# EAGLE design 4 (EAGLE 7.2.0)
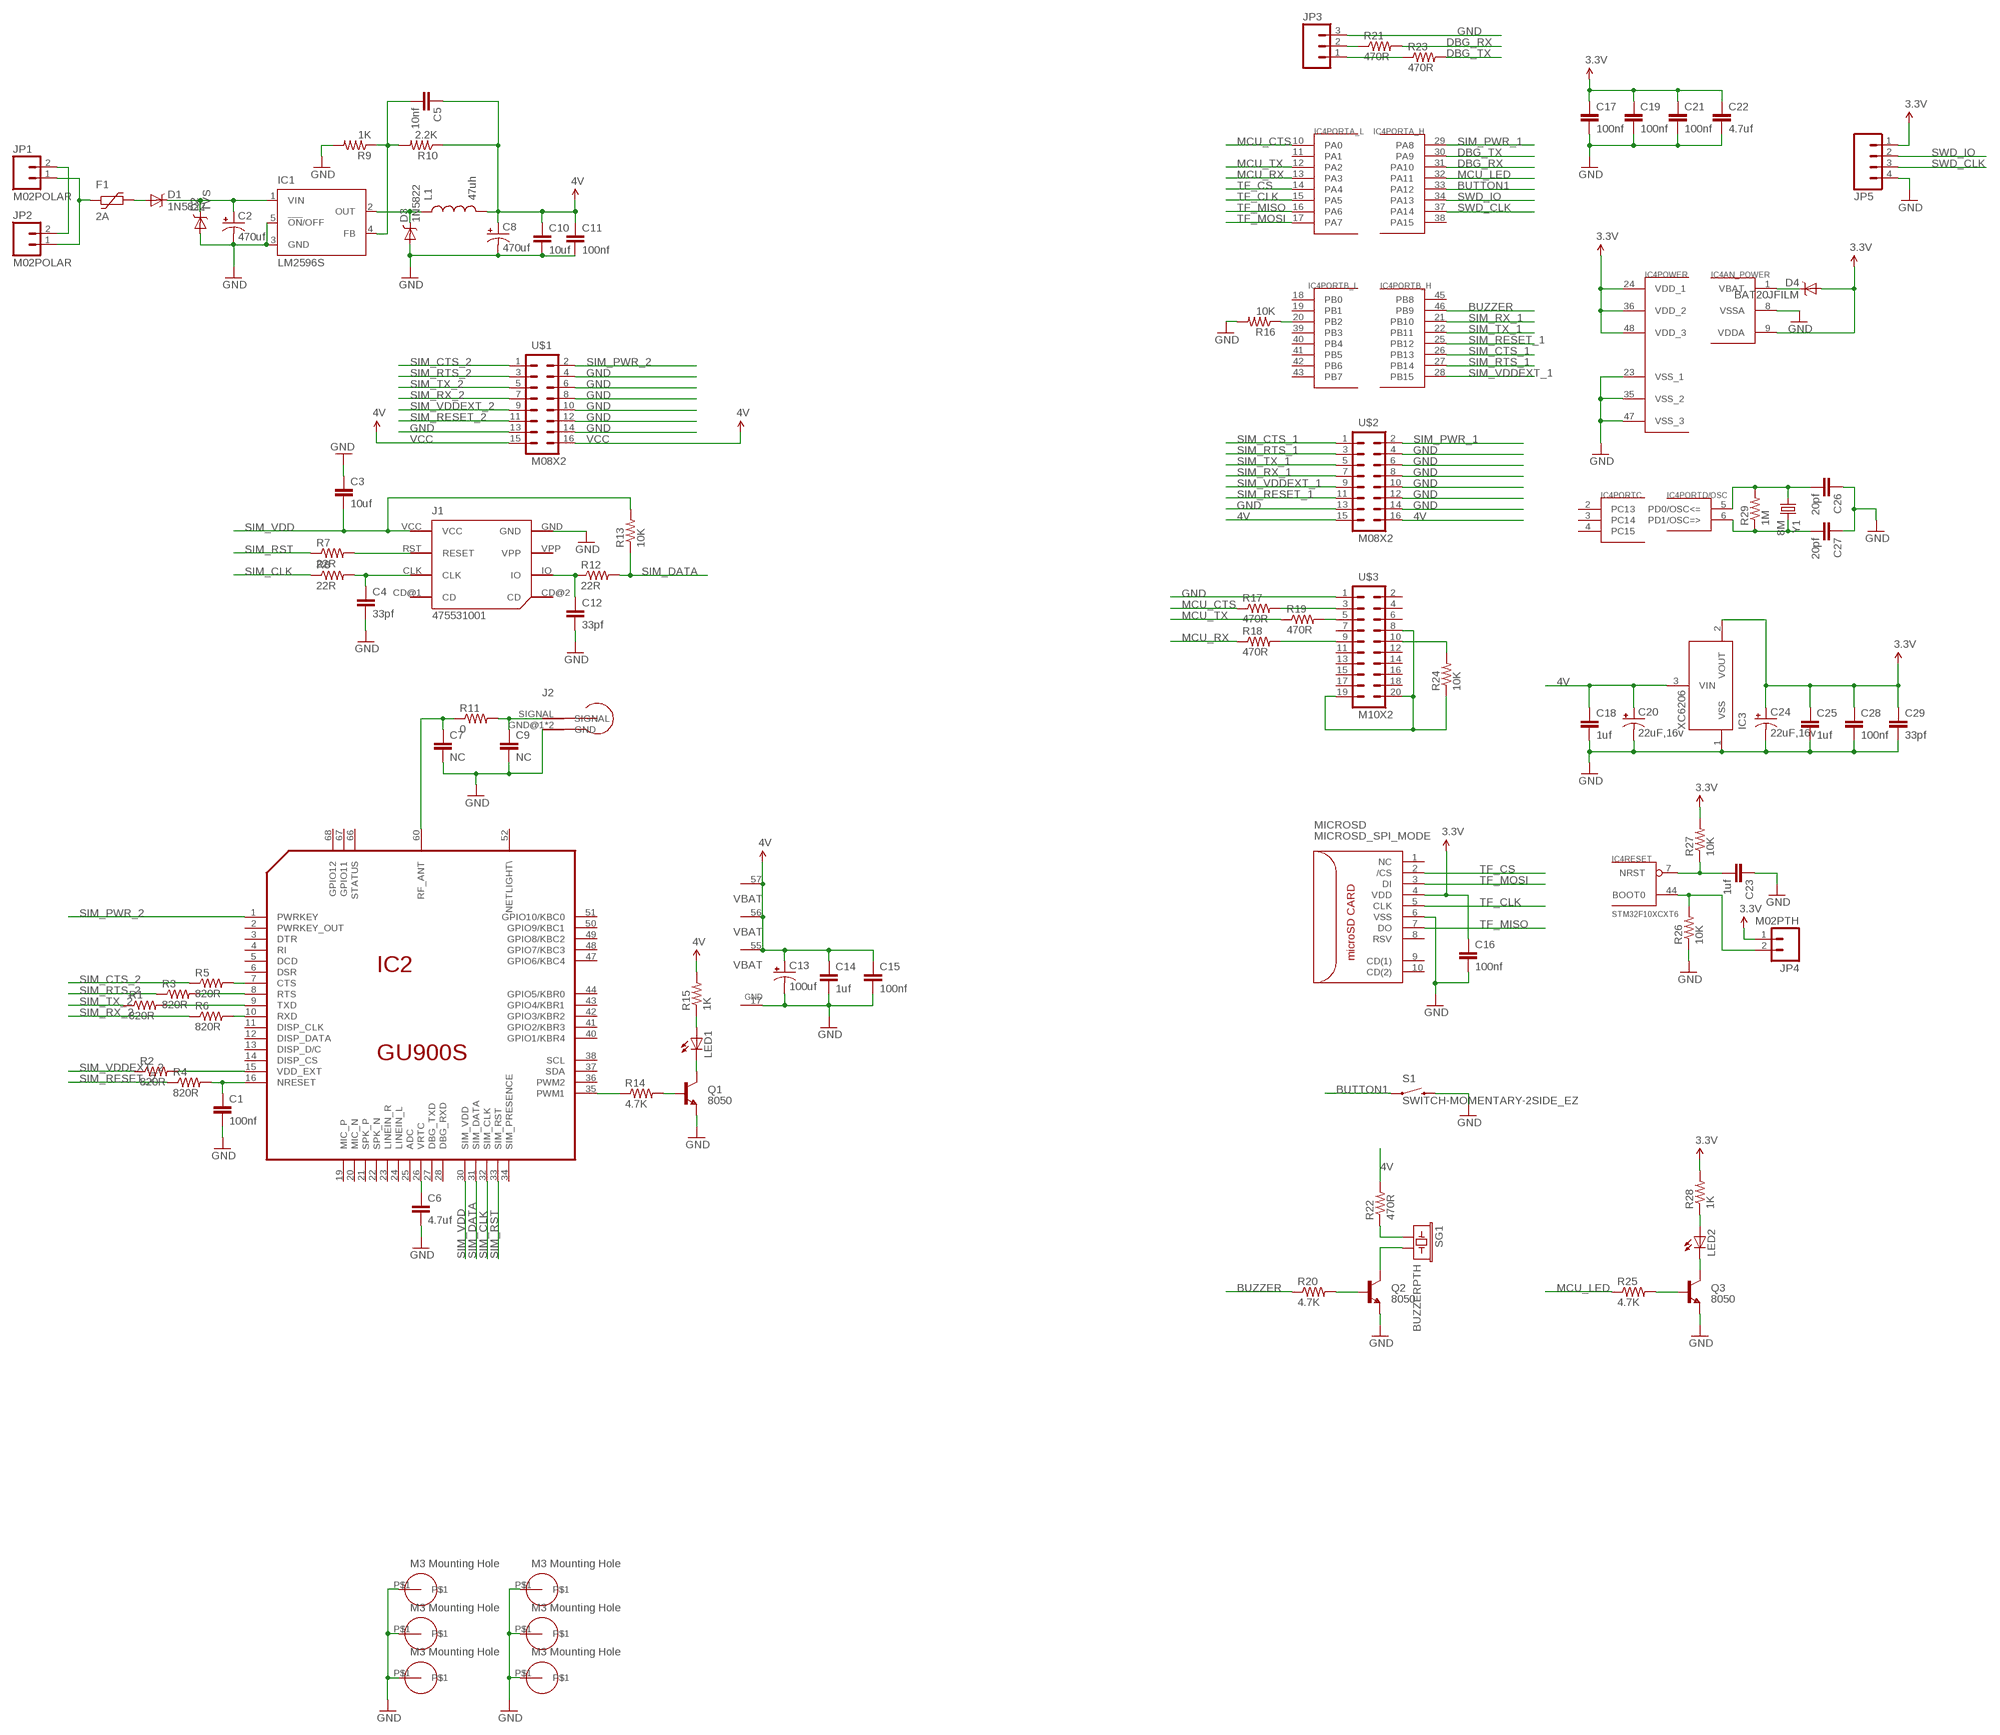
[diagram p0: schematic, sheet 1]

## Parts
C1  100nf  CAP0603-CAP  [0603-CAP]
C2  470uf  CAP_POLPTH4  [CPOL-RADIAL-1000UF-25V]
C3  10uf  CAP0603-CAP  [0603-CAP]
C4  33pf  CAP0603-CAP  [0603-CAP]
C5  10nf  CAP0603-CAP  [0603-CAP]
C6  4.7uf  CAP0603-CAP  [0603-CAP]
C7  NC  CAP0603-CAP  [0603-CAP]
C8  470uf  CAP_POLPTH4  [CPOL-RADIAL-1000UF-25V]
C9  NC  CAP0603-CAP  [0603-CAP]
C10  10uf  CAP0603-CAP  [0603-CAP]
C11  100nf  CAP0603-CAP  [0603-CAP]
C12  33pf  CAP0603-CAP  [0603-CAP]
C13  100uf  CAP_POL6032  [EIA6032]
C14  1uf  CAP0603-CAP  [0603-CAP]
C15  100nf  CAP0603-CAP  [0603-CAP]
C16  100nf  CAP0603-CAP  [0603-CAP]
C17  100nf  CAP0603-CAP  [0603-CAP]
C18  1uf  CAP0603-CAP  [0603-CAP]
C19  100nf  CAP0603-CAP  [0603-CAP]
C20  22uF,16v  10UF-20V-10%(TANT)  [EIA3528]
C21  100nf  CAP0603-CAP  [0603-CAP]
C22  4.7uf  CAP0603-CAP  [0603-CAP]
C23  1uf  CAP0603-CAP  [0603-CAP]
C24  22uF,16v  10UF-20V-10%(TANT)  [EIA3528]
C25  1uf  CAP0603-CAP  [0603-CAP]
C26  20pf  CAP0603-CAP  [0603-CAP]
C27  20pf  CAP0603-CAP  [0603-CAP]
C28  100nf  CAP0603-CAP  [0603-CAP]
C29  33pf  CAP0603-CAP  [0603-CAP]
D1  1N5822  DIODE-SCHOTTKT-SMB  [SMB-DIODE]
D2  TVS  TVS_SMB  [SMB-DIODE]
D3  1N5822  DIODE-SCHOTTKT-SMB  [SMB-DIODE]
D4  BAT20JFILM  [SOD-323]
F1  2A  PTC-FUSE1812L  [1812L]
IC1  LM2596S  [TO263-5]
IC2  GU900S  SIM900  [SIM900]
IC3  XC6206  [SOT23-3]
IC4  STM32F10XCXT6  [TQFP48]
J1  475531001  [475531001]
J2  IPEX  [IPEX]
JP1  M02POLAR  [MOLEX-1X2]
JP2  M02POLAR  [MOLEX-1X2]
JP3  M03PTH  [1X03]
JP4  M02PTH  [1X02]
JP5  M04PTH  [1X04]
L1  47uh  IHLP4040DZ  [IHLP4040DZ]
LED1  LEDSML0805  [SML0805]
LED2  LED3MM  [LED3MM]
MICROSD  MICROSD_SPI_MODE  [MICRO_SD_CONNECTOR]
Q1  8050  TRANSISTOR_NPNSOT23  [SOT23]
Q2  8050  TRANSISTOR_NPNSOT23  [SOT23]
Q3  8050  TRANSISTOR_NPNSOT23  [SOT23]
R1  820R  RESISTOR0603-RES  [0603-RES]
R2  820R  RESISTOR0603-RES  [0603-RES]
R3  820R  RESISTOR0603-RES  [0603-RES]
R4  820R  RESISTOR0603-RES  [0603-RES]
R5  820R  RESISTOR0603-RES  [0603-RES]
R6  820R  RESISTOR0603-RES  [0603-RES]
R7  22R  1M-1%  [0603-RES]
R8  22R  1M-1%  [0603-RES]
R9  1K  RESISTOR0603-RES  [0603-RES]
R10  2.2K  RESISTOR0603-RES  [0603-RES]
R11  0  1M-1%  [0603-RES]
R12  22R  1M-1%  [0603-RES]
R13  10K  1M-1%  [0603-RES]
R14  4.7K  1M-1%  [0603-RES]
R15  1K  RESISTOR0603-RES  [0603-RES]
R16  10K  1M-1%  [0603-RES]
R17  470R  1M-1%  [0603-RES]
R18  470R  1M-1%  [0603-RES]
R19  470R  1M-1%  [0603-RES]
R20  4.7K  1M-1%  [0603-RES]
R21  470R  1M-1%  [0603-RES]
R22  470R  1M-1%  [0603-RES]
R23  470R  1M-1%  [0603-RES]
R24  10K  1M-1%  [0603-RES]
R25  4.7K  1M-1%  [0603-RES]
R26  10K  RESISTOR0603-RES  [0603-RES]
R27  10K  RESISTOR0603-RES  [0603-RES]
R28  1K  1M-1%  [0603-RES]
R29  1M  1M-1%  [0603-RES]
S1  SWITCH-MOMENTARY-2SIDE_EZ  [TACTILE-PTH-SIDEEZ]
SG1  BUZZERPTH  [BUZZER-12MM]
U$1  M08X2  [2X8]
U$2  M08X2  [2X8]
U$3  M10X2  [2X10]
U$4  M3_MOUNTING_HOLE  [M3_MOUNTING_HOLE]
U$5  M3_MOUNTING_HOLE  [M3_MOUNTING_HOLE]
U$7  M3_MOUNTING_HOLE  [M3_MOUNTING_HOLE]
U$8  M3_MOUNTING_HOLE  [M3_MOUNTING_HOLE]
U$10  M3_MOUNTING_HOLE  [M3_MOUNTING_HOLE]
U$11  M3_MOUNTING_HOLE  [M3_MOUNTING_HOLE]
Y1  8M  CRYSTALHC49US  [HC49US]

## Nets
3.3V: C16.1 C17.1 C19.1 C21.1 C22.1 C24.A(+) C25.1 C28.1 C29.1 D4.2(A) IC3.2(VOUT) IC4.9(AN_POWER:VDDA) IC4.24(POWER:VDD_1) IC4.36(POWER:VDD_2) IC4.48(POWER:VDD_3) JP4.1 JP5.1 MICROSD.4(VDD) R27.2 R28.2
4V: C18.1 C20.A(+) IC3.3(VIN) R22.2 U$2.15 U$2.16
BUTTON1: IC4.33(PORTA_H:PA12) S1.1
BUZZER: IC4.46(PORTB_H:PB9) R20.1
DBG_RX: IC4.31(PORTA_H:PA10) R21.2
DBG_TX: IC4.30(PORTA_H:PA9) R23.2
GND: C1.2 C2.2(-) C3.1 C4.2 C6.2 C7.2 C8.2(-) C9.2 C10.2 C11.2 C12.2 C13.P$2(-) C14.2 C15.2 C16.2 C17.2 C18.2 C19.2 C20.C(-) C21.2 C22.2 C23.1 C24.C(-) C25.2 C26.1 C27.1 C28.2 C29.2 D2.A D3.A IC1.3(GND) IC1.5(!ON!/OFF) IC2.17(GND) IC3.1(VSS) IC4.8(AN_POWER:VSSA) IC4.23(POWER:VSS_1) IC4.35(POWER:VSS_2) IC4.47(POWER:VSS_3) J1.GND J2.GND@1(GND) J2.GND@2(GND) JP3.3 JP5.4 MICROSD.6(VSS) Q1.2(E) Q2.2(E) Q3.2(E) R9.2 R16.2 R26.1 S1.2 U$1.4 U$1.6 U$1.8 U$1.10 U$1.12 U$1.13 U$1.14 U$2.4 U$2.6 U$2.8 U$2.10 U$2.12 U$2.13 U$2.14 U$3.1 U$4.P$1 U$5.P$1 U$7.P$1 U$8.P$1 U$10.P$1 U$11.P$1
MCU_CTS: IC4.10(PORTA_L:PA0) R17.1
MCU_LED: IC4.32(PORTA_H:PA11) R25.1
MCU_RX: IC4.13(PORTA_L:PA3) R18.1
MCU_TX: IC4.12(PORTA_L:PA2) R19.1
N$1: D4.1(C) IC4.1(AN_POWER:VBAT)
N$2: C26.2 IC4.5(PORTD/OSC:PD0/OSC<=) R29.2 Y1.1
N$3: C27.2 IC4.6(PORTD/OSC:PD1/OSC=>) R29.1 Y1.2
N$4: C23.2 IC4.7(RESET:NRST) R27.1
N$5: IC4.44(RESET:BOOT0) JP4.2 R26.2
N$6: R24.1 U$3.8 U$3.19 U$3.20
N$7: JP1.2 JP2.2
N$8: D3.C IC1.2(OUT) L1.P$1
N$9: C2.1(+) D1.C D2.C IC1.1(VIN)
N$10: F1.P$1 JP1.1 JP2.1
N$11: C5.2 IC1.4(FB) R9.1 R10.2
N$12: R17.2 U$3.3
N$13: R19.2 U$3.5
N$14: LED1.C Q1.3(C)
N$15: R24.2 U$3.10
N$16: C7.1 IC2.60(RF_ANT) R11.1
N$17: IC4.20(PORTB_L:PB2) R16.1
N$18: C9.1 J2.SIGNAL R11.2
N$19: D1.A F1.P$2
N$20: IC2.15(VDD_EXT) R2.2
N$21: IC2.35(PWM1) R14.1
N$22: Q1.1(B) R14.2
N$23: LED1.A R15.1
N$24: J1.RST(RESET) R7.2
N$25: C6.1 IC2.26(VRTC)
N$27: Q3.1(B) R25.2
N$29: C1.1 IC2.16(NRESET) R4.2
N$30: IC2.7(CTS) R5.2
N$33: IC2.8(RTS) R3.2
N$34: IC2.9(TXD) R1.2
N$35: C12.1 J1.IO R12.1
N$36: IC2.10(RXD) R6.2
N$37: JP3.2 R21.1
N$38: JP3.1 R23.1
N$39: C4.1 J1.CLK R8.2
N$57: Q2.1(B) R20.2
N$58: R22.1 SG1.+
N$59: Q2.3(C) SG1.-
N$60: R18.2 U$3.9
N$61: LED2.A R28.1
N$62: LED2.K(C) Q3.3(C)
SIM_CLK: IC2.32(SIM_CLK) R8.1
SIM_CTS_1: IC4.26(PORTB_H:PB13) U$2.1
SIM_CTS_2: R5.1 U$1.1
SIM_DATA: IC2.31(SIM_DATA) R12.2 R13.1
SIM_PWR_1: IC4.29(PORTA_H:PA8) U$2.2
SIM_PWR_2: IC2.1(PWRKEY) U$1.2
SIM_RESET_1: IC4.25(PORTB_H:PB12) U$2.11
SIM_RESET_2: R4.1 U$1.11
SIM_RST: IC2.33(SIM_RST) R7.1
SIM_RTS_1: IC4.27(PORTB_H:PB14) U$2.3
SIM_RTS_2: R3.1 U$1.3
SIM_RX_1: IC4.21(PORTB_H:PB10) U$2.7
SIM_RX_2: R6.1 U$1.7
SIM_TX_1: IC4.22(PORTB_H:PB11) U$2.5
SIM_TX_2: R1.1 U$1.5
SIM_VDD: C3.2 IC2.30(SIM_VDD) J1.VCC R13.2
SIM_VDDEXT_1: IC4.28(PORTB_H:PB15) U$2.9
SIM_VDDEXT_2: R2.1 U$1.9
SWD_CLK: IC4.37(PORTA_H:PA14) JP5.3
SWD_IO: IC4.34(PORTA_H:PA13) JP5.2
TF_CLK: IC4.15(PORTA_L:PA5) MICROSD.5(CLK)
TF_CS: IC4.14(PORTA_L:PA4) MICROSD.2(/CS)
TF_MISO: IC4.16(PORTA_L:PA6) MICROSD.7(DO)
TF_MOSI: IC4.17(PORTA_L:PA7) MICROSD.3(DI)
VCC: C5.1 C8.1(+) C10.1 C11.1 C13.P$1(+) C14.1 C15.1 IC2.55(VBAT) IC2.56(VBAT) IC2.57(VBAT) L1.P$2 R10.1 R15.2 U$1.15 U$1.16 ; supply symbol labelled 4V
Unconnected: IC2.2(PWRKEY_OUT) IC2.3(DTR) IC2.4(RI) IC2.5(DCD) IC2.6(DSR) IC2.11(DISP_CLK) IC2.12(DISP_DATA) IC2.13(DISP_D/C) IC2.14(DISP_CS) IC2.19(MIC_P) IC2.20(MIC_N) IC2.21(SPK_P) IC2.22(SPK_N) IC2.23(LINEIN_R) IC2.24(LINEIN_L) IC2.25(ADC) IC2.27(DBG_TXD) IC2.28(DBG_RXD) IC2.34(SIM_PRESENCE) IC2.36(PWM2) IC2.37(SDA) IC2.38(SCL) IC2.40(GPIO1/KBR4) IC2.41(GPIO2/KBR3) IC2.42(GPIO3/KBR2) IC2.43(GPIO4/KBR1) IC2.44(GPIO5/KBR0) IC2.47(GPIO6/KBC4) IC2.48(GPIO7/KBC3) IC2.49(GPIO8/KBC2) IC2.50(GPIO9/KBC1) IC2.51(GPIO10/KBC0) IC2.52(NETLIGHT\) IC2.66(STATUS) IC2.67(GPIO11) IC2.68(GPIO12) IC4.2(PORTC:PC13) IC4.3(PORTC:PC14) IC4.4(PORTC:PC15) IC4.11(PORTA_L:PA1) IC4.18(PORTB_L:PB0) IC4.19(PORTB_L:PB1) IC4.38(PORTA_H:PA15) IC4.39(PORTB_L:PB3) IC4.40(PORTB_L:PB4) IC4.41(PORTB_L:PB5) IC4.42(PORTB_L:PB6) IC4.43(PORTB_L:PB7) IC4.45(PORTB_H:PB8) J1.CD@1(CD) J1.CD@2(CD) J1.VPP MICROSD.1(NC) MICROSD.8(RSV) MICROSD.9(CD(1)) MICROSD.10(CD(2)) U$3.2 U$3.4 U$3.6 U$3.7 U$3.11 U$3.12 U$3.13 U$3.14 U$3.15 U$3.16 U$3.17 U$3.18

## Power pins joined to a net without a drawn wire
GND: IC2.18(GND) IC2.29(GND) IC2.39(GND) IC2.45(GND) IC2.46(GND) IC2.53(GND) IC2.54(GND) IC2.58(GND) IC2.59(GND) IC2.61(GND) IC2.62(GND) IC2.63(GND) IC2.64(GND) IC2.65(GND)

## Library data of the parts
C1 C3-C7 C9-C12 C14-C19 C21-C23 C25-C29 = SparkFun-Passives:CAP: Capacitor Standard 0603 ceramic capacitor, and 0.1" leaded capacitor.
C2 C8 = SparkFun-Capacitors:CAP_POL: Capacitor Polarized These are standard SMD and PTH capacitors. Normally 10uF, 47uF, and 100uF in electrolytic and tantalum varieties. Always verify the external diameter of the through hole cap, it varies with capacity, voltage, and manufacturer. The EIA devices should be standard.
C13 = SparkFun-Passives:CAP_POL: Capacitor Polarized These are standard SMD and PTH capacitors. Normally 10uF, 47uF, and 100uF in electrolytic and tantalum varieties. Always verify the external diameter of the through hole cap, it varies with capacity, voltage, and manufacturer. The EIA devices should be standard.
C20 C24 = SparkFun-Capacitors:10UF-20V-10%(TANT): CAP-08063; PROD_ID: CAP-08063; VALUE: 10uF
D1 D3 = SparkFun-DiscreteSemi:DIODE-SCHOTTKT-SMB
D2 = SparkFun-DiscreteSemi:TVS_SMB
D4 = SparkFun-DiscreteSemi:BAT20JFILM: 23V, 1A Schottky diode, SOD-323 package; PROD_ID: DIO-11623
F1 = digital-toy:PTC-FUSE
IC1 = national-semiconductor:LM2596: SIMPLE SWITCHER® Power Converter 150 kHz 3A Step-Down Voltage Regulator Source: http://www.national.com/ds/LM/LM2596.pdf
IC2 = sim900:SIM900
IC3 = SparkFun-PowerIC:XC6206: Low ESR Cap. Compatible Positive Voltage Regulator
IC4 = stm32:STM32F10XCXT6: ST STM32F101/103 48pin LQFP
J1 = simcard:475531001: MOLEX SIM Card Holder 47553-1001 1.27mm Pitch SIM Card Holder with 2 Detect Pins, 6 Circuits, Push-Push Style, Housing Height 1.80mm, with Pegs, Lead-Free
J2 = SparkFun-RF:IPEX
JP1 JP2 JP4 = SparkFun-Connectors:M02: Standard 2-pin 0.1" header. Use with - straight break away headers ( PRT-00116) - right angle break away headers (PRT-00553) - swiss pins (PRT-00743) - machine pins (PRT-00117) - female headers (PRT-00115) Molex polarized connector foot print use with: PRT-08233 with associated crimp pins and housings. 2.54_SCREWTERM for use with PRT-10571. 3.5mm Screw Terminal footprints for PRT-08084 5mm Screw Terminal footprints for use with PRT-08433
JP3 = SparkFun-Connectors:M03: Header 3 Standard 3-pin 0.1" header. Use with straight break away headers (SKU : PRT-00116), right angle break away headers (PRT-00553), swiss pins (PRT-00743), machine pins (PRT-00117), and female headers (PRT-00115). Molex polarized connector foot print use with SKU : PRT-08232 with associated crimp pins and housings.
JP5 = SparkFun-Connectors:M04: Header 4 Standard 4-pin 0.1" header. Use with straight break away headers (SKU : PRT-00116), right angle break away headers (PRT-00553), swiss pins (PRT-00743), machine pins (PRT-00117), and female headers (PRT-00115). Molex polarized connector foot print use with SKU : PRT-08231 with associated crimp pins and housings. 1MM SMD Version SKU: PRT-10208
L1 = SparkFun-Passives:IHLP4040DZ
LED1 = led:LED: LED OSRAM: - CHIPLED LG R971, LG N971, LY N971, LG Q971, LY Q971, LO R971, LY R971 LH N974, LH R974 LS Q976, LO Q976, LY Q976 LO Q996 - Hyper CHIPLED LW Q18S LB Q993, LB Q99A, LB R99A - SideLED LS A670, LO A670, LY A670, LG A670, LP A670 LB A673, LV A673, LT A673, LW A673 LH A674 LY A675 LS A676, LA A676, LO A676, LY A676, LW A676 LS A679, LY A679, LG A679 - Hyper Micro SIDELED® LS Y876, LA Y876, LO Y876, LY Y876 LT Y87S - SmartLED LW L88C, LW L88S LB L89C, LB L89S, LG L890 LS L89K, LO L89K, LY L89K LS L896, LA L896, LO L896, LY L896 - TOPLED LS T670, LO T670, LY T670, LG T670, LP T670 LSG T670, LSP T670, LSY T670, LOP T670, LYG T670 LG T671, LOG T671, LSG T671 LB T673, LV T673, LT T673, LW T673 LH T674 LS T676, LA T676, LO T676, LY T676, LB T676, LH T676, LSB T676, LW T676 LB T67C, LV T67C, LT T67C, LS T67K, LO T67K, LY T67K, LW E67C LS E67B, LA E67B, LO E67B, LY E67B, LB E67C, LV E67C, LT E67C LW T67C LS T679, LY T679, LG T679 LS T770, LO T770, LY T770, LG T770, LP T770 LB T773, LV T773, LT T773, LW T773 LH T774 LS E675, LA E675, LY E675, LS T675 LS T776, LA T776, LO T776, LY T776, LB T776 LHGB T686 LT T68C, LB T68C - Hyper Mini TOPLED® LB M676 - Mini TOPLED Santana® LG M470 LS M47K, LO M47K, LY M47K Source: http://www.osram.convergy.de LUXEON: - LUMILED® LXK2-PW12-R00, LXK2-PW12-S00, LXK2-PW14-U00, LXK2-PW14-V00 LXK2-PM12-R00, LXK2-PM12-S00, LXK2-PM14-U00 LXK2-PE12-Q00, LXK2-PE12-R00, LXK2-PE12-S00, LXK2-PE14-T00, LXK2-PE14-U00 LXK2-PB12-K00, LXK2-PB12-L00, LXK2-PB12-M00, LXK2-PB14-N00, LXK2-PB14-P00, LXK2-PB14-Q00 LXK2-PR12-L00, LXK2-PR12-M00, LXK2-PR14-Q00, LXK2-PR14-R00 LXK2-PD12-Q00, LXK2-PD12-R00, LXK2-PD12-S00 LXK2-PH12-R00, LXK2-PH12-S00 LXK2-PL12-P00, LXK2-PL12-Q00, LXK2-PL12-R00 Source: www.luxeon.com KINGBRIGHT: KA-3528ASYC Source: www.kingbright.com
LED2 = SparkFun-LED:LED: LEDs Standard schematic elements and footprints for 5mm, 3mm, 1206, and 0603 sized LEDs. 5mm - Spark Fun Electronics SKU : COM-00529 (and others)
MICROSD = con-molex-microsd:MICROSD_SPI_MODE: MOLEX - 49225-0821 - CONNECTEUR MICRO SD PUSH/PUSH REV Fabricant: MOLEX Code commande Farnell: 1366700 <http://fr.farnell.com/molex/49225-0821/connecteur-micro-sd-push-push-rev/dp/1366700?Ntt=1366700> Référence fabricant: 49225-0821
Q1-Q3 = SparkFun-DiscreteSemi:TRANSISTOR_NPN: Generic NPN BJT MMBT2222A - TRANS-08049 (SOT-23, 1A 40V) MPSA42 - TRANS-09116 (SOT-23, 500mA 300V) MMBT5088LT1G - TRANS-11160 (SOT-23, 50 mA 30V)
R1-R6 R9 R10 R15 R26 R27 = SparkFun-Passives:RESISTOR: Resistor Basic schematic elements and footprints for 0603, 1206, and PTH resistors.
R7 R8 R11-R14 R16-R25 R28 = SparkFun-Resistors:1M-1%: 1M-ohm SMT 1/10W - 1% (0603) RES-07868; PROD_ID: RES-07868; VALUE: 1M
R29 = SparkFun-Resistors:1M-1%: 1M-ohm SMT 1/10W - 1% (0603) RES-07868; PROD_ID: RES-07868
S1 = SparkFun-Electromechanical:SWITCH-MOMENTARY-2: Various NO switches- pushbuttons, reed, etc
SG1 = SparkFun-Electromechanical:BUZZER: Buzzer 12mm Spark Fun Electronics SKU : Comp-Buzzer
U$1 U$2 = SparkFun-Connectors:M08X2: .1" headers, two rows of 8 each
U$3 = SparkFun-Connectors:M10X2: This was SPECIALLY designed to be used with our Graphic LCD Backpack. Be sure you want to use this! It is not only staggered on each line of header holes, but IT IS ALSO offset of the center point of the top and bottom lines by 5 mil. This causes the headers to lock into place on the "standard" footprint on the LCD screen. The extra squares on the tdocu layer are there simply to reference other pins (if you were to actually populate a longer header than ten long - this is what we do with the backpacks).
U$4 U$5 U$7 U$8 U$10 U$11 = SparkFun-Aesthetics:M3_MOUNTING_HOLE
Y1 = SparkFun-FreqCtrl:CRYSTAL: Various standard crystals. Proven footprints. Spark Fun Electronics SKU : COM-00534

## Board
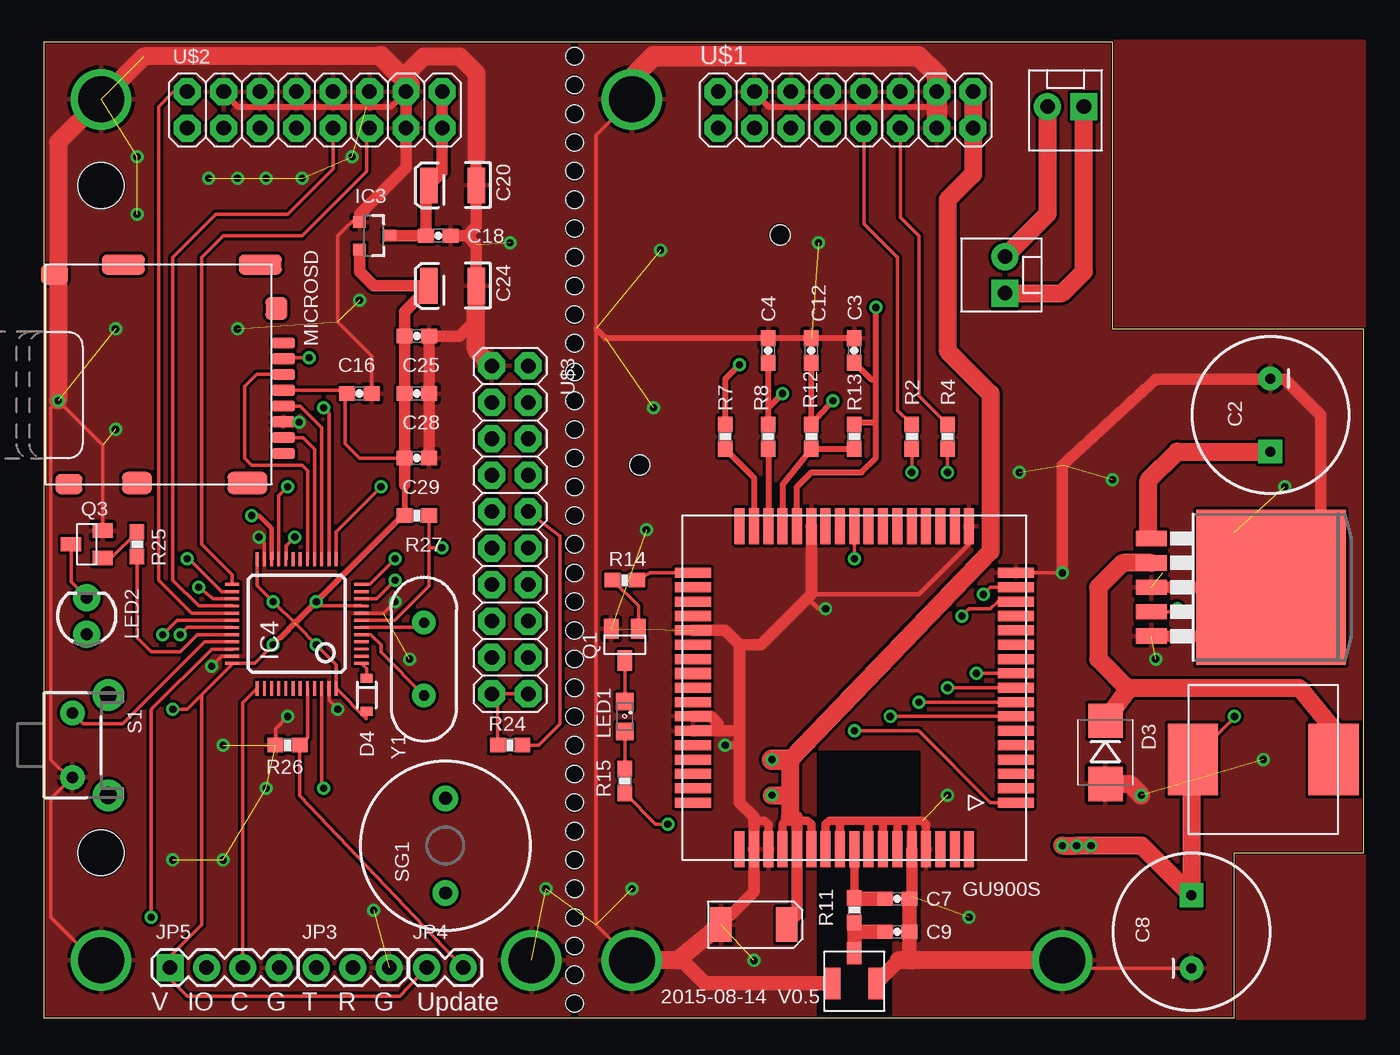
[diagram p1: board, top side]
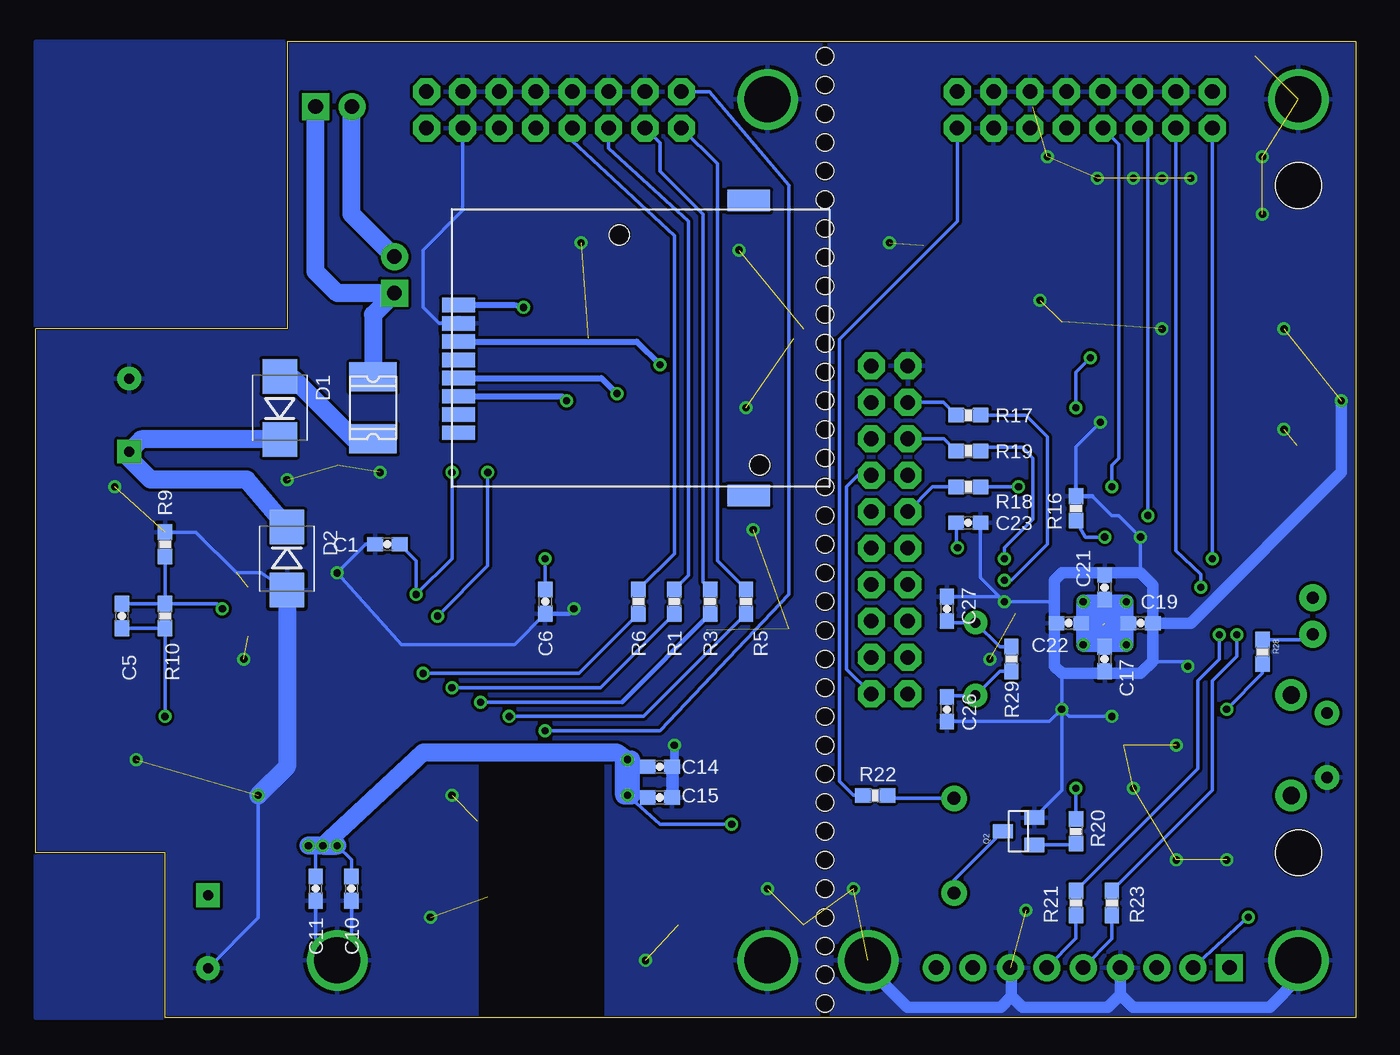
[diagram p2: board, bottom side, seen from below]

Size 92 x 68 mm. Coordinates in mm from the lower left corner, seen from the top.
Outline: 0,68 0,0 83,0 83,11.5 92,11.5 92,48 74.5,48 74.5,68 0,68
Copper layers (1*16): Top 0.035mm / dielectric 1.5mm / Bottom 0.035mm
Design rules "default *": minimum track width 10mil, minimum drill 14mil, track to track 8mil, track to pad 8mil, pad to pad 8mil, via to via 8mil, smd to smd 8mil, copper to edge 0.1mm, drill to drill 8mil, minimum pad ring 10mil, minimum via ring 8mil, stop-mask expansion 4mil, vias tented up to drill 0mil, thermal gap 10mil
Holes 1.2 mm at 37,67 37,65 37,63 37,61 37,59 37,57 37,55 37,53 37,51 37,41 37,39 37,37 37,35 37,33 37,31 37,29 37,27 37,25 37,23 37,21 37,19 37,17 37,15 37,49 37,47 37,45 37,43 37,13 37,11 37,9 37,7 37,5 37,3 37,1
Holes 3.2 mm at 4,58 4,11.5

### Footprints (pad centres in the part's own frame; a part is rotated, then mirrored left to right if it is on the bottom)
0603-CAP = smd 1.1 x 1: 1 -0.85,0; 2 0.85,0
CPOL-RADIAL-1000UF-25V = drill 0.7 pad 1.651 square: 1 2.54,0 | drill 0.7 pad 1.651: 2 -2.54,0
EIA6032 = smd 1.5 x 2.4: P$1 -2.3,0; P$2 2.3,0
EIA3528 = smd 1.2 x 2.5: A 1.65,0; C -1.65,0
SMB-DIODE = smd 2.4 x 2.4: A 2.2,0; C -2.2,0
SOD-323 = smd 0.63 x 0.83: 1 -1.15,0; 2 1.15,0
1812L = smd 2.03 x 3.3: P$1 -2.16,0; P$2 2.16,0
TO263-5 = smd 1.067 x 2.159: 1 -3.404,-5.791; 2 -1.702,-5.791; 3 0,-5.791; 4 1.702,-5.791; 5 3.404,-5.791 | smd 10.8 x 10.41: 6 0,2.54
SIM900 = smd 2.5 x 0.698: 1 -11.25,8; 2 -11.25,7; 3 -11.25,6; 4 -11.25,5; 5 -11.25,4; 6 -11.25,3; 7 -11.25,2; 8 -11.25,1; 9 -11.25,0; 10 -11.25,-1; 11 -11.25,-2; 12 -11.25,-3; 13 -11.25,-4; 14 -11.25,-5; 15 -11.25,-6; 16 -11.25,-7; 17 -11.25,-8; 35 11.25,-8; 36 11.25,-7; 37 11.25,-6; 38 11.25,-5; 39 11.25,-4; 40 11.25,-3; 41 11.25,-2; 43 11.25,0; 44 11.25,1; 45 11.25,2; 46 11.25,3; 47 11.25,4; 48 11.25,5; 49 11.25,6; 50 11.25,7; 51 11.25,8 | smd 0.698 x 2.5: 18 -8,-11.25; 19 -7,-11.25; 20 -6,-11.25; 21 -5,-11.25; 22 -4,-11.25; 23 -3,-11.25; 24 -2,-11.25; 25 -1,-11.25; 26 0,-11.25; 27 1,-11.25; 28 2,-11.25; 29 3,-11.25; 30 4,-11.25; 31 5,-11.25; 32 6,-11.25; 33 7,-11.25; 34 8,-11.25; 52 8,11.25; 53 7,11.25; 54 6,11.25; 55 5,11.25; 56 4,11.25; 57 3,11.25; 58 2,11.25; 59 1,11.25; 60 0,11.25; 61 -1,11.25; 62 -2,11.25; 63 -3,11.25; 64 -4,11.25; 65 -5,11.25; 66 -6,11.25; 67 -7,11.25; 68 -8,11.25 | smd 2.5 x 0.8: 42 11.25,-1
SOT23-3 = smd 0.8 x 0.9: 1 -0.95,-1; 2 0.95,-1; 3 0,1.1
TQFP48 = smd 0.2 x 1: 1 -2.75,-4.5; 2 -2.25,-4.5; 3 -1.75,-4.5; 4 -1.25,-4.5; 5 -0.75,-4.5; 6 -0.25,-4.5; 7 0.25,-4.5; 8 0.75,-4.5; 9 1.25,-4.5; 10 1.75,-4.5; 11 2.25,-4.5; 12 2.75,-4.5; 25 2.75,4.5; 26 2.25,4.5; 27 1.75,4.5; 28 1.25,4.5; 29 0.75,4.5; 30 0.25,4.5; 31 -0.25,4.5; 32 -0.75,4.5; 33 -1.25,4.5; 34 -1.75,4.5; 35 -2.25,4.5; 36 -2.75,4.5 | smd 1 x 0.2: 13 4.5,-2.75; 14 4.5,-2.25; 15 4.5,-1.75; 16 4.5,-1.25; 17 4.5,-0.75; 18 4.5,-0.25; 19 4.5,0.25; 20 4.5,0.75; 21 4.5,1.25; 22 4.5,1.75; 23 4.5,2.25; 24 4.5,2.75; 37 -4.5,2.75; 38 -4.5,2.25; 39 -4.5,1.75; 40 -4.5,1.25; 41 -4.5,0.75; 42 -4.5,0.25; 43 -4.5,-0.25; 44 -4.5,-0.75; 45 -4.5,-1.25; 46 -4.5,-1.75; 47 -4.5,-2.25; 48 -4.5,-2.75
475531001 = smd 2.3 x 1: CD@1 0.45,3.77; CD@2 0.45,5.04; CLK 0.45,7.58; GND 0.45,11.39; IO 0.45,6.31; RST 0.45,10.12; VCC 0.45,12.66; VPP 0.45,8.85 | smd 2.95 x 1.5: P$9 20.7,-0.6; P$10 20.7,19.95 | hole 1.4: 11.67,17.56; 21.47,1.51
IPEX = smd 2.2 x 1.05: GND@1 -0.1,1.5; GND@2 -0.1,-1.5 | smd 1.55 x 1: SIGNAL 2,0
MOLEX-1X2 = drill 1.016 pad 1.88 square: 1 0,0 | drill 1.016 pad 1.88: 2 2.54,0
1X03 = drill 1.016 pad 1.88: 1 0,0; 2 2.54,0; 3 5.08,0
1X02 = drill 1.016 pad 1.88: 1 0,0; 2 2.54,0
1X04 = drill 1.016 pad 1.88 square: 1 0,0 | drill 1.016 pad 1.88: 2 2.54,0; 3 5.08,0; 4 7.62,0
IHLP4040DZ = smd 3.5 x 5: P$1 -4.9,0; P$2 4.9,0
SML0805 = smd 1.2 x 1.2: A 1.05,0; C -1.05,0
LED3MM = drill 0.813 pad 1.88: A -1.27,0; K 1.27,0
MICRO_SD_CONNECTOR = smd 0.8 x 1.6: 1 -2.03,8.2; 2 -0.93,8.2; 3 0.17,8.2; 4 1.27,8.2; 5 2.37,8.2; 6 3.47,8.2; 7 4.57,8.2; 8 5.67,8.2 | smd 1.55 x 2.8: 9 7.735,5.7 | smd 1.55 x 2.1: 10 7.735,-2 | smd 1.4 x 1.9: 11 7.81,-6.75; 12 -6.79,-7.75 | smd 1.4 x 3: 13 -7.49,-2.95; 14 -7.49,6.6 | smd 1.6 x 1.55: 15 -4.43,7.725
SOT23 = smd 1 x 1.4: 1 -0.95,-1.1; 2 0.95,-1.1; 3 0,1.1
0603-RES = smd 1.1 x 1: 1 -0.85,0; 2 0.85,0
TACTILE-PTH-SIDEEZ = drill 0.8 pad 1.7: 1 -2.25,0; 2 2.25,0 | drill 1.2 pad 2.2: ANCHOR1 -3.5,2.5; ANCHOR2 3.5,2.5
BUZZER-12MM = drill 0.9 pad 1.778: + 3.3,0; - -3.3,0
2X8 = drill 1.016 pad 1.88 octagon: 1 0,0; 2 0,2.54; 3 2.54,0; 4 2.54,2.54; 5 5.08,0; 6 5.08,2.54; 7 7.62,0; 8 7.62,2.54; 9 10.16,0; 10 10.16,2.54; 11 12.7,0; 12 12.7,2.54; 13 15.24,0; 14 15.24,2.54; 15 17.78,0; 16 17.78,2.54
2X10 = drill 1.016 pad 1.88 octagon: 1 -11.43,-1.27; 2 -11.43,1.27; 3 -8.89,-1.27; 4 -8.89,1.27; 5 -6.35,-1.27; 6 -6.35,1.27; 7 -3.81,-1.27; 8 -3.81,1.27; 9 -1.27,-1.27; 10 -1.27,1.27; 11 1.27,-1.27; 12 1.27,1.27; 13 3.81,-1.27; 14 3.81,1.27; 15 6.35,-1.27; 16 6.35,1.27; 17 8.89,-1.27; 18 8.89,1.27; 19 11.43,-1.27; 20 11.43,1.27
M3_MOUNTING_HOLE = drill 3.2: P$1 0,0
HC49US = drill 0.7 pad 1.651: 1 -2.54,0; 2 2.54,0

### Placement (x,y rotation side)
C1  67.5,33 180 bottom
C2  85.5,42 270 top
C3  56.5,46.5 270 top
C4  50.5,46.5 90 top
C5  86,28 90 bottom
C6  56.5,29 270 bottom
C7  59.5,8.3 0 top
C8  80,6 90 top
C9  59.5,6 0 top
C10  70,9 270 bottom
C11  72.5,9 270 bottom
C12  53.5,46.5 90 top
C13  49.5,6.5 180 top
C14  48.5,17.5 0 bottom
C15  48.5,15.35 0 bottom
C16  22,43.5 0 top
C17  17.5,25 270 bottom
C18  27.5,54.5 0 top
C19  15,27.5 0 bottom
C20  28.5,58 180 top
C21  17.5,30 90 bottom
C22  20,27.5 180 bottom
C23  27,34.5 180 bottom
C24  28.5,51 180 top
C25  26,47.5 0 top
C26  28.5,21.5 90 bottom
C27  28.5,28.5 270 bottom
C28  26,43.5 0 top
C29  26,39 0 top
D1  75,42.5 90 bottom
D2  74.5,32 270 bottom
D3  74,18.5 270 top
D4  22.5,22.5 270 top
F1  68.5,42.5 270 bottom
IC1  83,30 270 top
IC2  56.5,23 180 top
IC3  23,54.5 270 top
IC4  17.63,27.45 90 top
J1  63,37 0 bottom
J2  56.5,2.5 90 top
JP1  72.5,63.5 180 top
JP2  67,50.5 90 top
JP3  19,3.5 0 top
JP4  26.7,3.5 0 top
JP5  8.8,3.5 0 top
L1  85,18 180 top
LED1  40.5,21 270 top
LED2  3,28 90 top
MICROSD  8.5,45 270 top
Q1  40.5,26 180 top
Q2  23.5,13 90 bottom
Q3  3,33 90 top
R1  47.5,29 270 bottom
R2  60.5,40.5 270 top
R3  45,29 270 bottom
R4  63,40.5 270 top
R5  42.5,29 270 bottom
R6  50,29 270 bottom
R7  47.5,40.5 90 top
R8  50.5,40.5 90 top
R9  83,33 90 bottom
R10  83,28 90 bottom
R11  56.5,7.5 270 top
R12  53.5,40.5 270 top
R13  56.5,40.5 90 top
R14  40.5,30.5 180 top
R15  40.5,16.5 270 top
R16  19.5,35.5 90 bottom
R17  27,42 180 bottom
R18  27,37 180 bottom
R19  27,39.5 180 bottom
R20  19.5,13 270 bottom
R21  19.5,8 90 bottom
R22  33.5,15.5 180 bottom
R23  17,8 90 bottom
R24  32.5,19 0 top
R25  6.5,33 90 top
R26  17,19 0 top
R27  26,35 180 top
R28  6.5,25.5 270 bottom
R29  24,25 270 bottom
S1  2,19 270 top
SG1  28,12 90 top
U$1  47,62 0 top
U$2  10,62 0 top
U$3  32.5,34 270 top
U$4  4,64 0 top
U$5  4,4 0 top
U$7  34,4 0 top
U$8  41,64 0 top
U$10  41,4 0 top
U$11  71,4 0 top
Y1  26.5,25 90 top

### Tracks (layer width: path | path; a pad name or v marks a point on that pad's centre or on a via)
3.3V  (via drill 0.5)  (1 unrouted)
  Top 0.254: IC4.24 14.88,30.12 v16,29 17.62,27.38 | IC4.9 18.7,28.7 18.5,28.5 | 16.5,26.5 v16,26 14.7,24.7 IC4.36 13.13,24.63 11,22.5 | 17.62,27.38 v19,26 20.38,24.62 IC4.48 22.48,20.85 D4.2 | 17.62,27.38 17.62,27.62 | 11,22.5 11,6.5 8.8,4.3 JP5.1 8.8,2.7 10,1.5 24.8,1.5 JP4.1 | v9,21.5 10,21.5 11,22.5 | C24.A 26.52,50.59 26.47,50.52 26.42,50.46 | MICROSD.4 20.92,43.73 C16.1 21,43.35 21,40 22,39 C29.1
  Top 0.406: 16.5,26.5 17.62,27.62 18.5,28.5 v19,29 25.15,35.15 R27.2 25.15,37.15
  Top 0.813: 25.15,37.15 C29.1 C28.1 C25.1 25.15,49.2 26.47,50.52 | IC3.2 22,52 23,51 C24.A
  Bottom 0.254: R28.2 6.5,24 v9,21.5
  Bottom 0.813: C19.1 15.88,27.5 | 17.5,29.12 C21.1 | C22.1 19.25,27.5 | 17.5,25.75 C17.1
  Bottom 1.016: C19.1 16,27.5 | 16,27.5 v16,26 17.35,26 C17.1 | C21.1 17.35,29 v16,29 16,27.5 | C22.1 19,27.35 v19,26 17.5,26 | 16.75,28.75 16.75,26.75 18.25,26.75 18.25,28.25 17.5,28.25 17.5,27.5 | 17.5,29 v19,29 19,27.75
4V
  Top 0.813: U$2.16 U$2.15 27.78,58.93 C20.A 26.65,57.7 C18.1 IC3.3
  Bottom 0.254: R22.2 35,15.5 36,16.5 36,47.28 27.78,55.5 U$2.15
BUTTON1
  Top 0.254: IC4.33 11.2,26.2 5.5,20.5 2.75,20.5 S1.1
BUZZER  (via drill 0.5)
  Top 0.254: v19.5,16 19.38,16.12 IC4.46
  Bottom 0.254: R20.1 v19.5,16
DBG_RX  (via drill 0.5)
  Top 0.254: IC4.31 10,27.2 v9.5,26.7
  Bottom 0.254: R21.2 11,17.35 11,23.5 9.5,25 v9.5,26.7
DBG_TX  (via drill 0.5)
  Top 0.254: IC4.30 9.3,27.7 v8.3,26.7
  Bottom 0.254: R23.2 10,15.85 10,23.5 8.3,25.2 v8.3,26.7
GND  (via drill 0.5)  (36 unrouted)
  Top 0.254: U$8.P$1 38.5,61.5 38.5,48 38.5,6.5 U$10.P$1 | IC4.47 19.88,22.12 v20.5,21.5 | IC4.23 15.38,33.12 v15,33.5 | 22.7,28.2 IC4.8 23.7,28.2 v24.5,29 | MICROSD.6 17.47,41.53 v17.8,41.5 | U$5.P$1 3.5,4 0.5,7 0.5,15.25 S1.2 1.75,16.75 0.5,18 0.5,42.5 v1,43 4.1,39.9 Q3.2 | R26.1 16.15,20.15 v17,21 | IC4.35 12.4,25.2 v11.7,24.5 | 22,56 20.5,54.5 20.5,48.5 22.85,46.15 C16.2 | IC2.17 v71,31 | C8.2 71.54,3.46 U$11.P$1
  Top 0.305: IC2.18 64.5,33 61,29.5 53.5,29.5 | v54.5,28.5 54,28.5 53.25,29.25
  Top 0.406: C4.2 C12.2 C3.1 39.15,47.35 38.5,48 | U$2.4 12.54,64.46 13.5,63.5 15,63.5 | 15,63.5 17.5,63.5 | 17.5,63.5 20,63.5 | 20,63.5 22.5,63.5 | 22.5,63.5 24.2,63.5 U$2.14 | U$2.6 15.08,63.58 15,63.5 | U$2.8 17.62,63.62 17.5,63.5 | U$2.10 20.16,63.66 20,63.5 | U$2.12 22.7,63.7 22.5,63.5 | U$1.4 49.54,64.46 50.5,63.5 52,63.5 | 52,63.5 54.5,63.5 | 54.5,63.5 57,63.5 | 57,63.5 59.5,63.5 | 59.5,63.5 61.74,63.5 62.24,64 | U$1.6 52.08,63.58 52,63.5 | U$1.8 54.62,63.62 54.5,63.5 | U$1.10 57.16,63.66 57,63.5 | U$1.12 59.7,63.7 59.5,63.5
  Top 0.61: v47.5,19 48.5,19 | IC2.54 50.5,13.5 50.25,13.75 49.5,13.75 | IC2.58 54.5,13.5 54.75,13.75 55.5,13.75 | 55.5,13.75 57.5,13.75 | 57.5,13.75 58.5,13.75 | 58.5,13.75 59.5,13.75 | 59.5,13.75 60.5,13.75 | 60.5,13.75 61.25,13.75 61.5,13.5 IC2.65 | IC2.59 55.5,13.75 | IC2.61 57.5,13.75 | IC2.62 58.5,13.75 | IC2.63 59.5,13.75 | IC2.64 60.5,13.75
  Top 0.813: C13.P$2 49.5,8.8 IC2.53 49.5,13.75 49.5,14 48.5,15 48.5,19 48.5,20 | 48.5,20 47,20 | 47,20 IC2.46 | IC2.39 47.5,27 48.5,26 | 48.5,26 48.5,20 | IC2.29 53.5,29.5 53.25,29.25 50,26 48.5,26 | IC2.45 46.5,21 47,20.5 47,20 | U$2.14 U$2.13 25.24,59.24 22,56 IC3.1 | C25.2 C28.2 C29.2 26.85,47.35 27,47.5 29,47.5 30.15,48.65 30.15,49.5 C24.C 30.15,53.85 29.5,54.5 | 30.15,60.15 30.15,60 C20.C 30.15,55.15 29.5,54.5 | C18.2 29.5,54.5 | C7.2 60.5,8.45 IC2.64 | IC1.3 86,30 | 86,30 89,33 89,42 86.5,44.5 85.54,44.5 C2.2 85.46,44.5 77.5,44.5 71,38.5 v71,31 | IC1.5 82.6,26.6 86,30
  Top 1.016: 44.35,4.15 46.1,2.4 J2.GND@1 | C7.2 C9.2 60.35,4.15 60.5,4 | J2.GND@2 59.6,4
  Top 1.27: C13.P$2 44.35,4.15 44.2,4 U$10.P$1 | U$11.P$1 60.5,4 59.6,4 | U$2.14 25.24,65.74 26.5,67 29,67 30.15,65.85 30.15,60 | 23.5,67 7,67 1,61 v1,43 | D3.A 75.7,16.3 v76.5,15.5 | U$3.1 30.15,46.51 30.15,49.5
  Top 1.422: U$1.13 62.24,64 U$1.14 62.24,65.74 60.98,67 42.5,67 41,65.5 U$8.P$1 | 23.5,67 25.5,65 25.5,64.8 U$2.14
  Bottom 0.254: v20.5,21.5 20.5,24 | Q2.2 20.5,15.85 v20.5,21.5 | 15,31 v15,33.5 16.5,35 17,35 18.35,36.35 | 21.3,28.8 21,28.5 | v17.8,41.5 19.5,39.8 R16.2 | v24.5,29 21,29 | C23.1 26.15,30.65 v24.5,29 | v17,21 20,21 v20.5,21.5 | 14.15,25 13.95,24.8 12,24.8 v11.7,24.5 | 62.89,48.39 J1.GND 63.89,48.39 65,49.5 65,53.5 62.24,56.26 U$1.13 | 28.35,29 C27.1 24.85,29.35 v24.5,29 | C26.1 21.35,20.65 v20.5,21.5 | C6.2 58.65,26 66.5,26 v71,31 69,33 C1.2 | R9.2 80.85,33.85 78,31 76.3,31 D2.A | C10.2 70,5 U$11.P$1 72.5,5.5 C11.2 | v76.5,15.5 76.5,6.96 C8.2
  Bottom 0.305: C6.2 54.85,28.15 v54.5,28.5 | R16.2 18.35,36.35 | 21.2,29.3 21,29.5
  Bottom 0.61: C15.2 47.5,15.75 v47.5,19
  Bottom 0.813: C14.2 C15.2 | C19.2 14.15,25 14.15,24.85 15,24 17.35,24 C17.2 | C19.2 14.15,30.15 15,31 17.35,31 | 17.35,31 C21.2 | 17.35,31 20.5,31 21,30.5 21,29.5 21,29 21,28.5 21,27.65 | 21,27.65 C22.2 | 21,27.65 21,24.5 20.5,24 17.5,24 | JP5.4 16.42,1.62 | 16.42,1.62 15.55,0.75 6,0.75 4,2.75 U$5.P$1 | U$7.P$1 34,3.5 31.25,0.75 24.75,0.75 24,1.5 | 16.42,1.62 17.29,0.75 23.25,0.75 24,1.5 | v1,43 1,38 11.5,27.5 C19.2 | 24,1.5 24,3.42 JP3.3
  Bottom 1.27: D2.A 74.5,17.5 v76.5,15.5
  other vias: 6.5,60 6.5,56 5,48 5,41 11.5,58.5 13.5,58.5 15.5,58.5 18,58.5 21.5,60 13.5,48 22,50 25.5,25 35,9 43,53.5 42.5,42.5 41,9 63,15.5 49.5,4 64.5,7 77.5,25 9,11 15.5,16 12.5,11 12.5,19 23,7.5 32.5,54 54,54 42,34 68,38 74.5,37.5 86.5,37 85,18
  cutout Top: 54,0 59,0 59,5.5 61,5.5 61,18.5 54,18.5
  pour Top: 0,68 0,0 92,0 92,68
  pour Bottom: 0,68 92,68 92,0 0,0
MCU_CTS  (via drill 0.5)
  Top 0.254: IC4.10 23.2,29.2 v24.5,30.5
  Bottom 0.254: R17.1 23,42 21.5,40.5 21.5,33 24,30.5 v24.5,30.5
MCU_LED
  Top 0.254: IC4.32 10.7,26.7 9.5,25.5 7.5,25.5 6.5,26.5 R25.1
MCU_RX  (via drill 0.5)
  Top 0.254: IC4.13 20.38,33.88 v23.5,37
  Bottom 0.254: v23.5,37 R18.1
MCU_TX  (via drill 0.5)
  Top 0.254: IC4.12 22.7,30.2 v24.5,32
  Bottom 0.254: v24.5,32 24.5,32.75 22.5,34.75 22.5,39 23.25,39.75 25.9,39.75 R19.1
N$1
  Top 0.254: IC4.1 22.5,24.33 D4.1
N$2
  Top 0.254: IC4.5 22.8,26.7 23.5,26 23.5,25.46 Y1.1
  Bottom 0.254: R29.2 24.81,24.15 Y1.1 28.39,22.46 arc-90 C26.2
N$3
  Top 0.254: IC4.6 26.16,27.2 Y1.2
  Bottom 0.254: R29.1 24.81,25.85 Y1.2 28.11,27.54 C27.2
N$4  (via drill 0.5)
  Top 0.254: IC4.7 24.45,27.7 26.85,30.1 26.85,32.75 | 26.85,32.75 R27.1 | v27.75,32.75 26.85,32.75
  Bottom 0.254: C23.2 27.85,32.85 v27.75,32.75
N$5
  Top 0.254: IC4.44 18.38,19.53 R26.2 17.85,15.49 JP4.2
N$6
  Top 0.254: U$3.20 U$3.19 31.65,22.15 R24.1
  Bottom 0.254: U$3.8 34.69,37.81 35.5,37 35.5,24.3 U$3.20
N$7
  Top 1.27: JP1.2 69.96,56 JP2.2
N$8
  Top 1.27: D3.C 75.6,22.9 | 75.6,22.9 75.7,23 87.5,23 89.9,20.1 L1.P$1 | IC1.2 75.2,31.7 73.5,30 73.5,25 75.6,22.9
N$9
  Top 1.016: IC1.1 77.11,33.5 77,33.5
  Top 1.27: 77,33.5 77,37.46 79,39.46 C2.1
  Bottom 1.27: D2.C 77.3,37.5 84,37.5 85.5,39 C2.1 84.66,40.3 D1.C
N$10
  Top 1.27: JP2.1 71,50.5 72.5,52 JP1.1
  Bottom 1.27: JP1.1 72.5,52 71,50.5 JP2.1 68.5,49 F1.P$1
N$11  (via drill 0.5)
  Top 0.254: IC1.4 78.8,28.3 v79,28.5
  Bottom 0.254: C5.2 R10.2 | R10.2 R9.1 | v79,28.5 79.35,28.85 R10.2
N$12
  Bottom 0.254: R17.2 28.74,42.89 U$3.3
N$13
  Bottom 0.254: R19.2 28.7,40.35 U$3.5
N$14
  Top 0.254: LED1.C Q1.3
N$15
  Top 0.254: R24.2 34.5,19 36,20.5 36,33.54 U$3.10
N$16
  Top 0.61: IC2.60 R11.1
  Top 1.016: C7.1 56.55,8.3 R11.1
N$17  (via drill 0.5)
  Top 0.254: IC4.20 16.88,32.88 v17.5,33.5
  Bottom 0.254: v17.5,33.5 18.85,33.5 R16.1
N$18
  Top 1.016: J2.SIGNAL 56.5,6 | 56.5,6 R11.2 | C9.1 56.5,6
N$19
  Bottom 1.27: F1.P$2 69.84,40.34 74,44.5 74.8,44.5 D1.A
N$20  (via drill 0.5)
  Top 0.254: R2.2 v60.5,38 | v64,28 64.5,28.5 66,28.5 66.5,29 IC2.15
  Bottom 0.254: v60.5,38 60.5,31.5 v64,28
N$21
  Top 0.254: IC2.35 42.25,31 R14.1
N$22
  Top 0.254: R14.2 41.45,28.7 Q1.1
N$23
  Top 0.254: R15.1 LED1.A
N$24  (via drill 0.5)
  Top 0.406: v48.5,45.5 47.5,44.5 R7.2
  Bottom 0.406: J1.RST 50.12,47.12 v48.5,45.5
N$25  (via drill 0.5)
  Top 0.254: IC2.26 v56.5,32
  Bottom 0.254: v56.5,32 C6.1
N$27
  Top 0.254: R25.2 4.7,32.05 Q3.1
N$29  (via drill 0.5)
  Top 0.254: R4.2 v63,38 | v65.5,29.5 66,30 IC2.16
  Bottom 0.254: v63,38 63,32 v65.5,29.5 65.5,31.85 C1.1
N$30  (via drill 0.5)
  Top 0.254: IC2.7 v59,21
  Bottom 0.254: v59,21 49.65,21 R5.2
N$33  (via drill 0.5)
  Top 0.254: IC2.8 v61,22
  Bottom 0.254: v61,22 51.15,22
  Bottom 0.305: 51.15,22 R3.2
N$34  (via drill 0.5)
  Top 0.254: IC2.9 v63,23
  Bottom 0.254: v63,23 52.65,23 R1.2
N$35  (via drill 0.5)
  Top 0.406: C12.1 R12.1 v55,43
  Bottom 0.406: J1.IO 55.31,43.31 v55,43
N$36  (via drill 0.5)
  Top 0.254: v65,24 IC2.10
  Bottom 0.254: R6.2 54.15,24 v65,24
N$37
  Bottom 0.254: R21.1 19.5,5.54 JP3.2
N$38
  Bottom 0.254: R23.1 17,5.5 JP3.1
N$39  (via drill 0.5)
  Top 0.406: R8.2 50.5,42.5 | 50.5,42.5 C4.1 | v51.5,43.5 50.5,42.5
  Bottom 0.406: J1.CLK 52.58,44.58 v51.5,43.5
N$57
  Bottom 0.254: Q2.1 19.6,12.05 R20.2
N$58
  Bottom 0.254: SG1.+ 32.45,15.3 R22.1
N$59
  Bottom 0.254: Q2.3 28,9.6 SG1.-
N$60
  Bottom 0.254: R18.2 29.5,37 U$3.9
N$61
  Bottom 0.254: LED2.A 3.38,26.35 R28.1
N$62
  Top 0.254: Q3.3 1.9,30.37 LED2.K
N$63
  cutout Bottom: 52.5,18.5 52.5,0 61,0 61,18.5
N$71
  Bottom 1.27: 67,53 70,56 70,63.5
SIM_CLK
  Top 0.406: R8.1 IC2.32
SIM_CTS_1  (via drill 0.5)
  Top 0.254: IC4.26 12.4,29.7 10.1,32 v10,32
  Bottom 0.254: U$2.1 v10,32
SIM_CTS_2
  Bottom 0.254: R5.1 44.5,31.85 44.5,59.5 U$1.1
SIM_DATA
  Top 0.406: R13.1 R12.2 51.5,37.15 IC2.31
SIM_PWR_1
  Top 0.254: IC4.29 10.3,28.2 8,30.5 8,63.5 9,64.5 9.96,64.5 U$2.2
SIM_PWR_2  (via drill 0.5)
  Top 0.254: 68.5,15 IC2.1 66,15 61,20 v56.5,20
  Bottom 0.254: v56.5,20 48.5,20 39.5,29.5 39.5,58 45.04,64.54 U$1.2
SIM_RESET_1
  Top 0.254: IC4.25 13.13,30.87 11,33 11,53 12.5,54.5 18,54.5 22.5,59 22.5,61.8 U$2.11
SIM_RESET_2
  Top 0.254: R4.1 61,43.35 61,54.5 59.7,55.8 U$1.11
SIM_RST
  Top 0.406: R7.1 49.5,37.65 IC2.33
SIM_RTS_1  (via drill 0.5)
  Top 0.254: IC4.27 11.8,29.2 v10.8,30
  Bottom 0.254: U$2.3 12.54,32.54 10.8,30.9 v10.8,30
SIM_RTS_2
  Bottom 0.254: R3.1 45.5,30.35 45.5,56 48.5,59 48.5,60.96 U$1.3
SIM_RX_1  (via drill 0.5)
  Top 0.254: IC4.21 16.38,36.38 v17,37
  Bottom 0.254: v17,37 17,38.5 16.5,39 16.5,60.88 U$2.7
SIM_RX_2
  Bottom 0.254: R6.1 47.5,32.35 47.5,54.5 54.62,61.12 U$1.7
SIM_TX_1  (via drill 0.5)
  Top 0.305: IC4.22 15.88,34.12 15,35 v14.5,35
  Bottom 0.254: v14.5,35 14.5,61.42 U$2.5
SIM_TX_2
  Bottom 0.254: R1.1 46.5,30.85 46.5,55.5 52.08,60.58 U$1.5
SIM_VDD  (via drill 0.5)
  Top 0.406: IC2.30 52.5,37 53.5,38 57,38 58,39 58,41.5 | 58,41.5 58,44.5 | 58,44.5 v58,49.5 | R13.2 56.65,41.5 58,41.5 | C3.2 57.65,44.5 58,44.5
  Bottom 0.406: v58,49.5 58.66,49.66 J1.VCC
SIM_VDDEXT_1
  Top 0.254: IC4.28 10.8,28.7 9,30.5 9,53 12,56 17,56 20.16,59.16 U$2.9
SIM_VDDEXT_2
  Top 0.254: R2.1 59.5,42.35 59.5,53 57.16,55.34 U$1.9
SWD_CLK
  Top 0.254: IC4.37 13.88,21.95 JP5.3
SWD_IO  (via drill 0.5)
  Top 0.254: IC4.34 11.7,25.7 7.5,21.5 v7.5,7
  Bottom 0.254: v7.5,7 7.54,7 JP5.2
TF_CLK
  Top 0.254: IC4.15 19.38,41.12 17.87,42.63 MICROSD.5
TF_CS  (via drill 0.5)
  Top 0.254: IC4.14 19.88,42.12 v19.5,42.5 | v18.5,46 16.77,46 MICROSD.2
  Bottom 0.254: v19.5,42.5 19.5,45 v18.5,46
TF_MISO
  Top 0.254: IC4.16 18.88,39.62 18.07,40.43 MICROSD.7
TF_MOSI
  Top 0.254: IC4.17 18.38,38.12 18,38.5 14.5,38.5 14,39 14,44 14.83,44.83 MICROSD.3
VCC  (via drill 0.5)
  Top 0.254: v43.5,13.5 42.65,13.5 R15.2 | 79,19.5 L1.P$2 83,20.9 v83,21
  Top 0.61: IC2.55 51.5,13.5 52,14 | IC2.57 53.5,13.5 53.25,13.75 52.5,13.75
  Top 0.813: 52,14 52.5,14 52.5,13.75 IC2.56 52.5,7.2 C13.P$1
  Top 1.27: 52,15.5 52,18 66,32.5 66,43.5 63,46.5 63,57 64.78,58.78 U$1.15 U$1.16 | 52,15.5 52,14 | v50.75,15.5 52,15.5 | 73.25,12 v73,12 | v71,12 v72,12 v73,12 | L1.P$2 80,17.9 C8.1 76.54,12 v73,12
  Top 1.422: v50.75,18 52,18
  Bottom 0.254: C5.1 R10.1 v83,21 | v43.5,13.5 48.5,13.5 v50.75,15.5 | C10.1 70,11 v71,12 | C11.1 72.5,12
  Bottom 0.61: C14.1 v50.75,18 | C15.1 49.45,15.5 v50.75,15.5
  Bottom 1.27: 50.5,18 50.5,15.5 51,15.5 51,18 v50.75,18 51.5,18.5 65,18.5 v72,12 v71,12 72.5,12 v73,12

### Text on the board
tPlace: 2015-08-14 V0.5
tNames: V | IO | C | G | T | R | G | Update